# Altium schematic sheet Motor_Controller.SchDoc
size A4
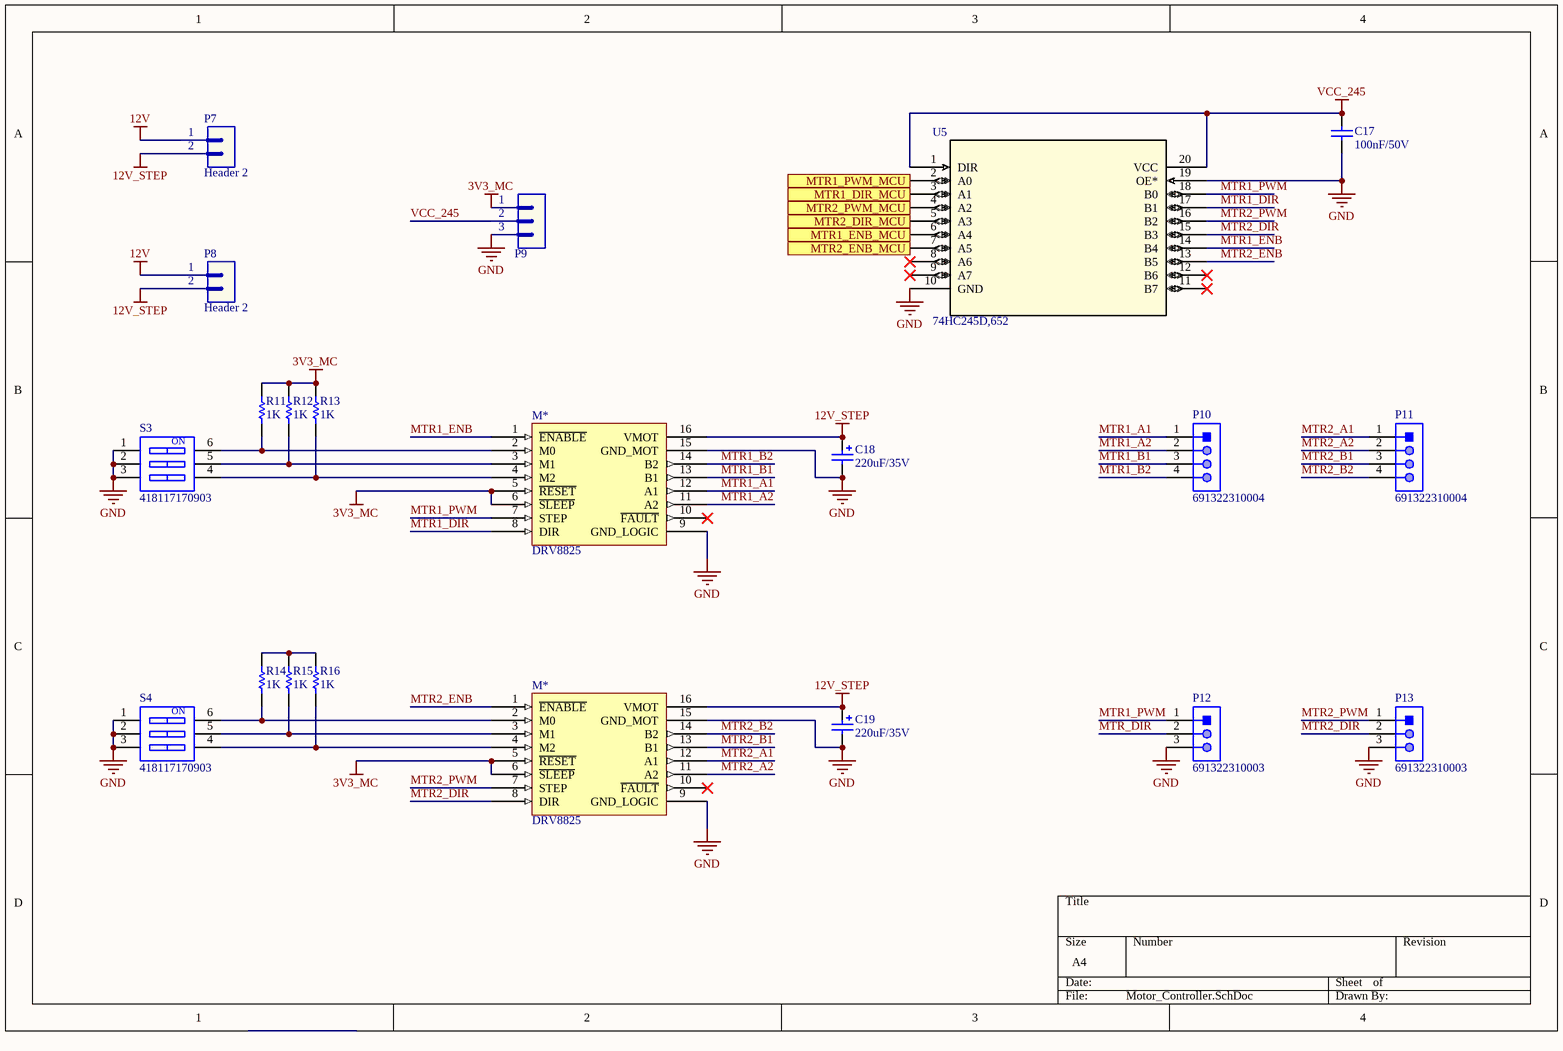
[diagram p0: Motor_Controller.SchDoc]

## Parts
(Parts that share a designator on the sheet are numbered #1, #2 ... from top to bottom, then left to right.)
C17  value 100nF/50V  [CAP-SM-0805]  (hidden comment: Cap-100nF-50V-0805)
C18  value 220uF/35V  [CAP-SM-AL-SIZE-F-D8L10]  (hidden comment: Cap-Al-220uF-35V-D8L10)
C19  value 220uF/35V  [CAP-SM-AL-SIZE-F-D8L10]  (hidden comment: Cap-Al-220uF-35V-D8L10)
M*#1  DRV8825  [IC_DRV8825_STEPPER_MOTOR_DRIVER_CARRIER]
M*#2  DRV8825  [IC_DRV8825_STEPPER_MOTOR_DRIVER_CARRIER]
P7  Header 2  [JP2]
P8  Header 2  [JP2]
P9  Header 3  [JP3]  (value not drawn)
P10  691322310004  [691322310004]
P11  691322310004  [691322310004]
P12  691322310003  [691322310003]
P13  691322310003  [691322310003]
R11  value 1K  [RES-SM-0805]  (hidden comment: Res-1K-0805)
R12  value 1K  [RES-SM-0805]  (hidden comment: Res-1K-0805)
R13  value 1K  [RES-SM-0805]  (hidden comment: Res-1K-0805)
R14  value 1K  [RES-SM-0805]  (hidden comment: Res-1K-0805)
R15  value 1K  [RES-SM-0805]  (hidden comment: Res-1K-0805)
R16  value 1K  [RES-SM-0805]  (hidden comment: Res-1K-0805)
S3  418117170903  [418117170903]
S4  418117170903  [418117170903]
U5  74HC245D,652  [SOT163-1_NEX]

## Ports
MTR1_DIR_MCU (in), MTR1_ENB_MCU (in), MTR1_PWM_MCU (in), MTR2_DIR_MCU (in), MTR2_ENB_MCU (in), MTR2_PWM_MCU (in)

## Nets
3V3_MC: M*#1.5(~{RESET}) M*#1.6(~{SLEEP}) M*#2.5(~{RESET}) M*#2.6(~{SLEEP}) P9.1 R11.1 R12.1 R13.1
12V: P7.1 P8.1
12V_STEP: C18.1 C19.1 M*#1.16(VMOT) M*#2.16(VMOT) P7.2 P8.2
GND: C17.1 C18.2 C19.2 M*#1.9(GND_LOGIC) M*#1.15(GND_MOT) M*#2.9(GND_LOGIC) M*#2.15(GND_MOT) P9.3 P12.3 P13.3 S3.1 S3.2 S3.3 S4.1 S4.2 S4.3 U5.10(GND) U5.19(OE*)
VCC_245: C17.2 P9.2 U5.1(DIR) U5.20(VCC)
MTR1_A1: M*#1.12(A1) P10.1
MTR1_A2: M*#1.11(A2) P10.2
MTR1_B1: M*#1.13(B1) P10.3
MTR1_B2: M*#1.14(B2) P10.4
MTR1_DIR: M*#1.8(DIR) U5.17(B1)
MTR1_DIR_MCU: U5.3(A1) ; port MTR1_DIR_MCU
MTR1_ENB: M*#1.1(~{ENABLE}) U5.14(B4)
MTR1_ENB_MCU: U5.6(A4) ; port MTR1_ENB_MCU
MTR1_PWM: M*#1.7(STEP) P12.1 U5.18(B0)
MTR1_PWM_MCU: U5.2(A0) ; port MTR1_PWM_MCU
MTR2_A1: M*#2.12(A1) P11.1
MTR2_A2: M*#2.11(A2) P11.2
MTR2_B1: M*#2.13(B1) P11.3
MTR2_B2: M*#2.14(B2) P11.4
MTR2_DIR: M*#2.8(DIR) P13.2 U5.15(B3)
MTR2_DIR_MCU: U5.5(A3) ; port MTR2_DIR_MCU
MTR2_ENB: M*#2.1(~{ENABLE}) U5.13(B5)
MTR2_ENB_MCU: U5.7(A5) ; port MTR2_ENB_MCU
MTR2_PWM: M*#2.7(STEP) P13.1 U5.16(B2)
MTR2_PWM_MCU: U5.4(A2) ; port MTR2_PWM_MCU
MTR_DIR: P12.2
NetM*#1_2: M*#1.2(M0) R11.2 S3.6
NetM*#1_3: M*#1.3(M1) R12.2 S3.5
NetM*#1_4: M*#1.4(M2) R13.2 S3.4
NetM*#2_2: M*#2.2(M0) R14.2 S4.6
NetM*#2_3: M*#2.3(M1) R15.2 S4.5
NetM*#2_4: M*#2.4(M2) R16.2 S4.4
NetR14_1: R14.1 R15.1 R16.1

Not connected (* = marked no-connect by the designer): M*#1 10(~{FAULT})*; M*#2 10(~{FAULT})*; U5 8(A6)* 9(A7)* 11(B7)* 12(B6)*

## Notes on the sheet
- (in symbol 418117170903) ON

## Library data of the parts
C17 = Cap-100nF-50V-0805: CAP CER 0.1UF 50V Y5V 0805; Manufacturer: Samsung Electro-Mechanics; Manufacturer Part Number: CL21F104ZBCNNNC; Local Supplier: thegioiic; Local Supplier Link: https://thegioiic.com/products/tu-100nf-0-1uf-50v-0805; Supplier 1: Digikey; Supplier 1 Part Number: 1276-1007-1-ND; Supplier 1 Link: https://www.digikey.com/product-detail/en/samsung-electro-mechanics/CL21F104ZBCNNNC/1276-1007-1-ND/3889093
C18 C19 = Cap-Al-220uF-35V-D8L10: CAP ALUM 220UF 20% 35V SMD; Manufacturer: Nichicon; Manufacturer Part Number: UWT1V221MNL1GS; Local Supplier: thegioiic; Local Supplier Link: https://thegioiic.com/products/tu-nhom-smd-220uf-35v-d8l10; Supplier 1: Digikey; Supplier 1 Link: https://www.digikey.com/product-detail/en/nichicon/UWT1V221MNL1GS/493-2205-2-ND/589946; Supplier 1 Part Number: 493-2205-2-ND
P7 P8 = Header 2: Header, 2-Pin; LatestRevisionDate: 17-Jul-2002; LatestRevisionNote: Re-released for DXP Platform.; Publisher: Altium Limited
P9 = Header 3: Header, 3-Pin; LatestRevisionDate: 17-Jul-2002; LatestRevisionNote: Re-released for DXP Platform.; Publisher: Altium Limited
P10 P11 = 691322310004: WR-TBL Serie 322 Horizontal PCB Header, Pluggable, pitch 3.81mm, 4p; Compliance: RoHS; Modularity: No; Pin Number: 4; Rated Current [UL]: 10A; Working Voltage [UL]: 300VAC; ComponentLink1Description: Manufacturer; ComponentLink1URL: http://www.we-online.de; ComponentLink2URL: https://katalog.we-online.de/em/datasheet/691322310004.pdf; ComponentLink2Description: Datasheet; Mounting Technology: THT; Part Number: 691322310004; Packaging: Box; Operating Temperature: -40 to +105degC; PCB/Cable/Panel: PCB; Pitch: 3.81mm; Published Date: October 2019; Type: Horizontal; Publisher: Wurth Elektronik; Application: Pluggable
P12 P13 = 691322310003: WR-TBL Serie 322 Horizontal PCB Header, Pluggable, pitch 3.81mm, 3p; Compliance: RoHS; Modularity: No; Pin Number: 3; Rated Current [UL]: 10A; Working Voltage [UL]: 300VAC; ComponentLink1Description: Manufacturer; ComponentLink1URL: http://www.we-online.de; ComponentLink2URL: https://katalog.we-online.de/em/datasheet/691322310003.pdf; ComponentLink2Description: Datasheet; Mounting Technology: THT; Part Number: 691322310003; Packaging: Box; Operating Temperature: -40 to +105degC; PCB/Cable/Panel: PCB; Pitch: 3.81mm; Published Date: October 2019; Type: Horizontal; Publisher: Wurth Elektronik; Application: Pluggable
R11-R16 = Res-1K-0805: RES 1K OHM 1% 1/4W 0805; Manufacturer: Stackpole Electronics Inc; Manufacturer Part Number: RNCP0805FTD1K00; Local Supplier: thegioiic; Local Supplier Link: https://thegioiic.com/products/dien-tro-1k-ohm-0805-5; Supplier 1: Digikey; Supplier 1 Link: https://www.digikey.com/product-detail/en/stackpole-electronics-inc/RNCP0805FTD1K00/RNCP0805FTD1K00CT-ND/2240568; Supplier 1 Part Number: RNCP0805FTD1K00CT-ND
S3 S4 = 418117170903: WS-DITV Compact THT Dip Switch, Flat Actuator, pitch 2.54mm, 3p; Operation Force: 800g; Pole Number: 3; Actuator Type: Flat Type; Circuit: SPST-NO; Rated Current Switching: 25mA; Rated Current Non-Switching: 100mA; Rated Voltage Non-Switching: 50VDC; Rated Voltage Switching: 24VDC; ComponentLink1Description: Manufacturer; ComponentLink1URL: http://www.we-online.de; ComponentLink2Description: Datasheet; ComponentLink2URL: https://katalog.we-online.com/em/datasheet/418117170903.pdf; Pitch: 2.54mm; Contact Material: Copper Alloy; Mounting Technology: THT; Operating Temperature: -40 to +85degC; Contact Plating: Gold; Packaging: Tube; Part Number: 418117170903; Publisher: Wurth Elektronik; Published Date: September 2019
U5 = 74HC245D,652: No Description Available; Vendor: Nexperia; SourceLibrary: Nexperia_2018-05-2018; Manufacturer_Part_Number: 74HC245D,652; Copyright: Copyright (C) 2016 Accelerated Designs. All rights reserved; RefDes: RefDes; Type: DEV